# Altium schematic sheet FPGA-Supply.SchDoc
size A2; Date: Date; CompanyName: HESSO; Engineer: Name; Address1: Route du Rawyl 47; Address2: 1950 Sion; Address3: Switzerland; ProjectName: Project Name
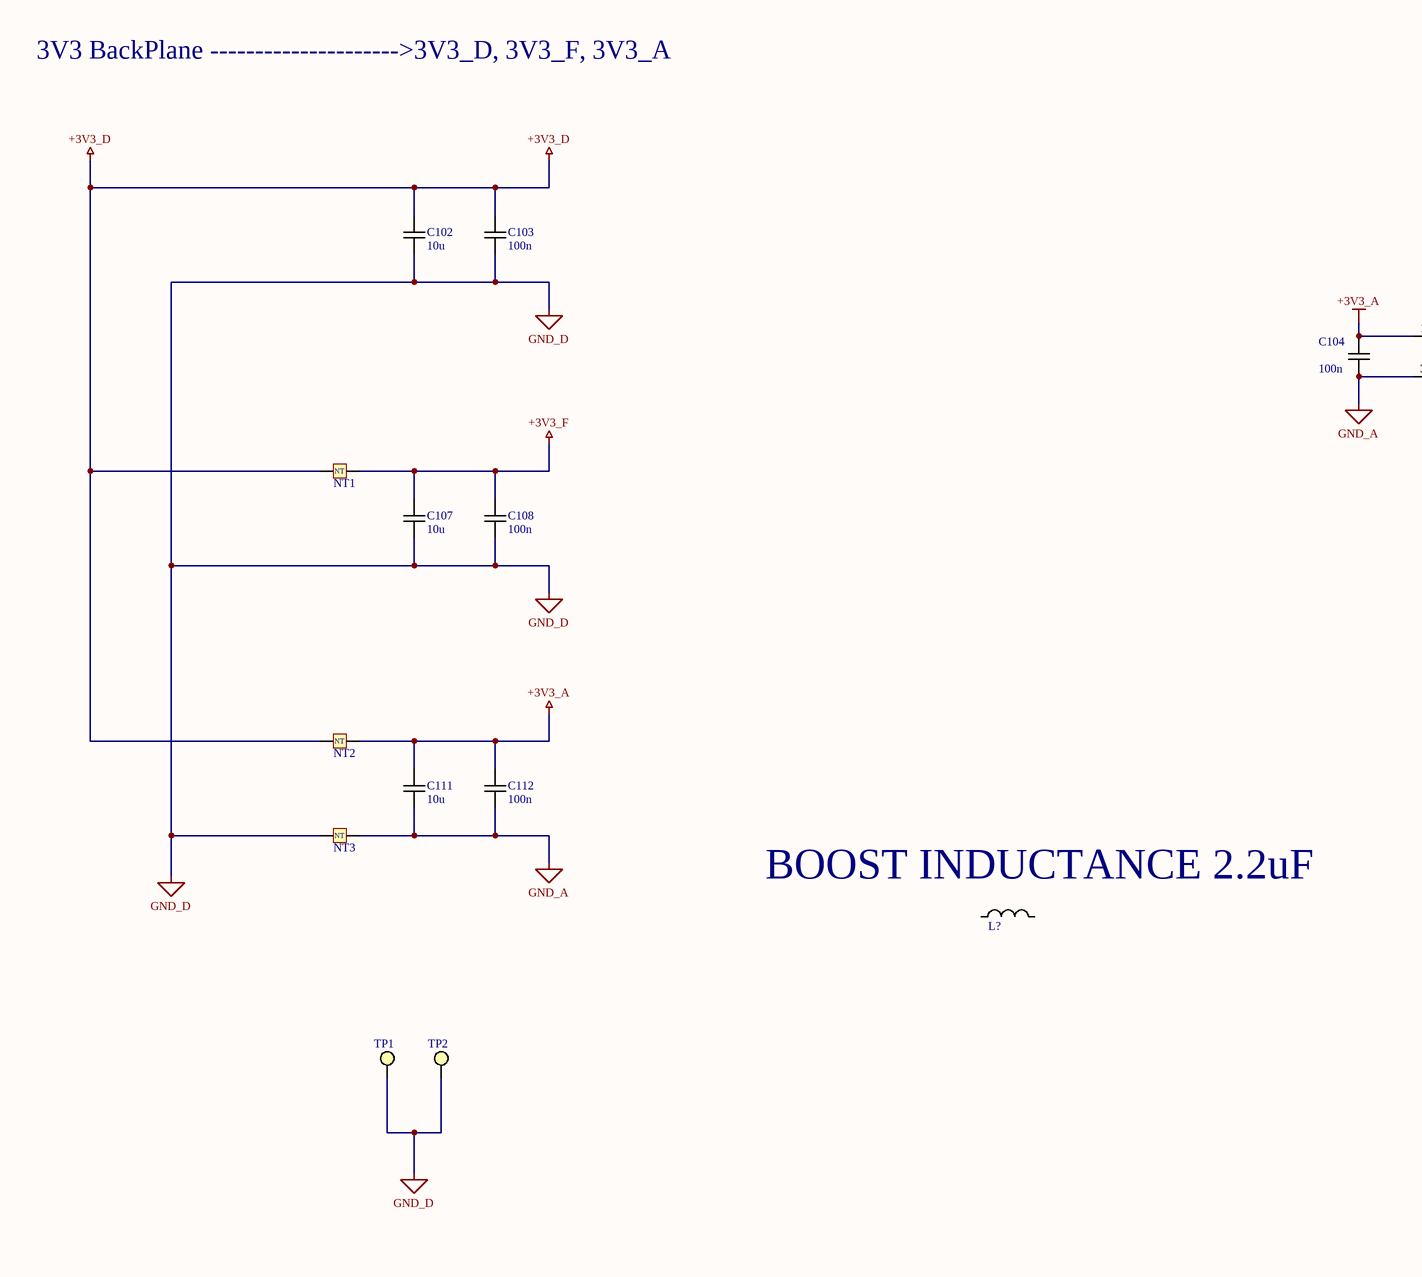
[diagram p0: FPGA-Supply.SchDoc, left]
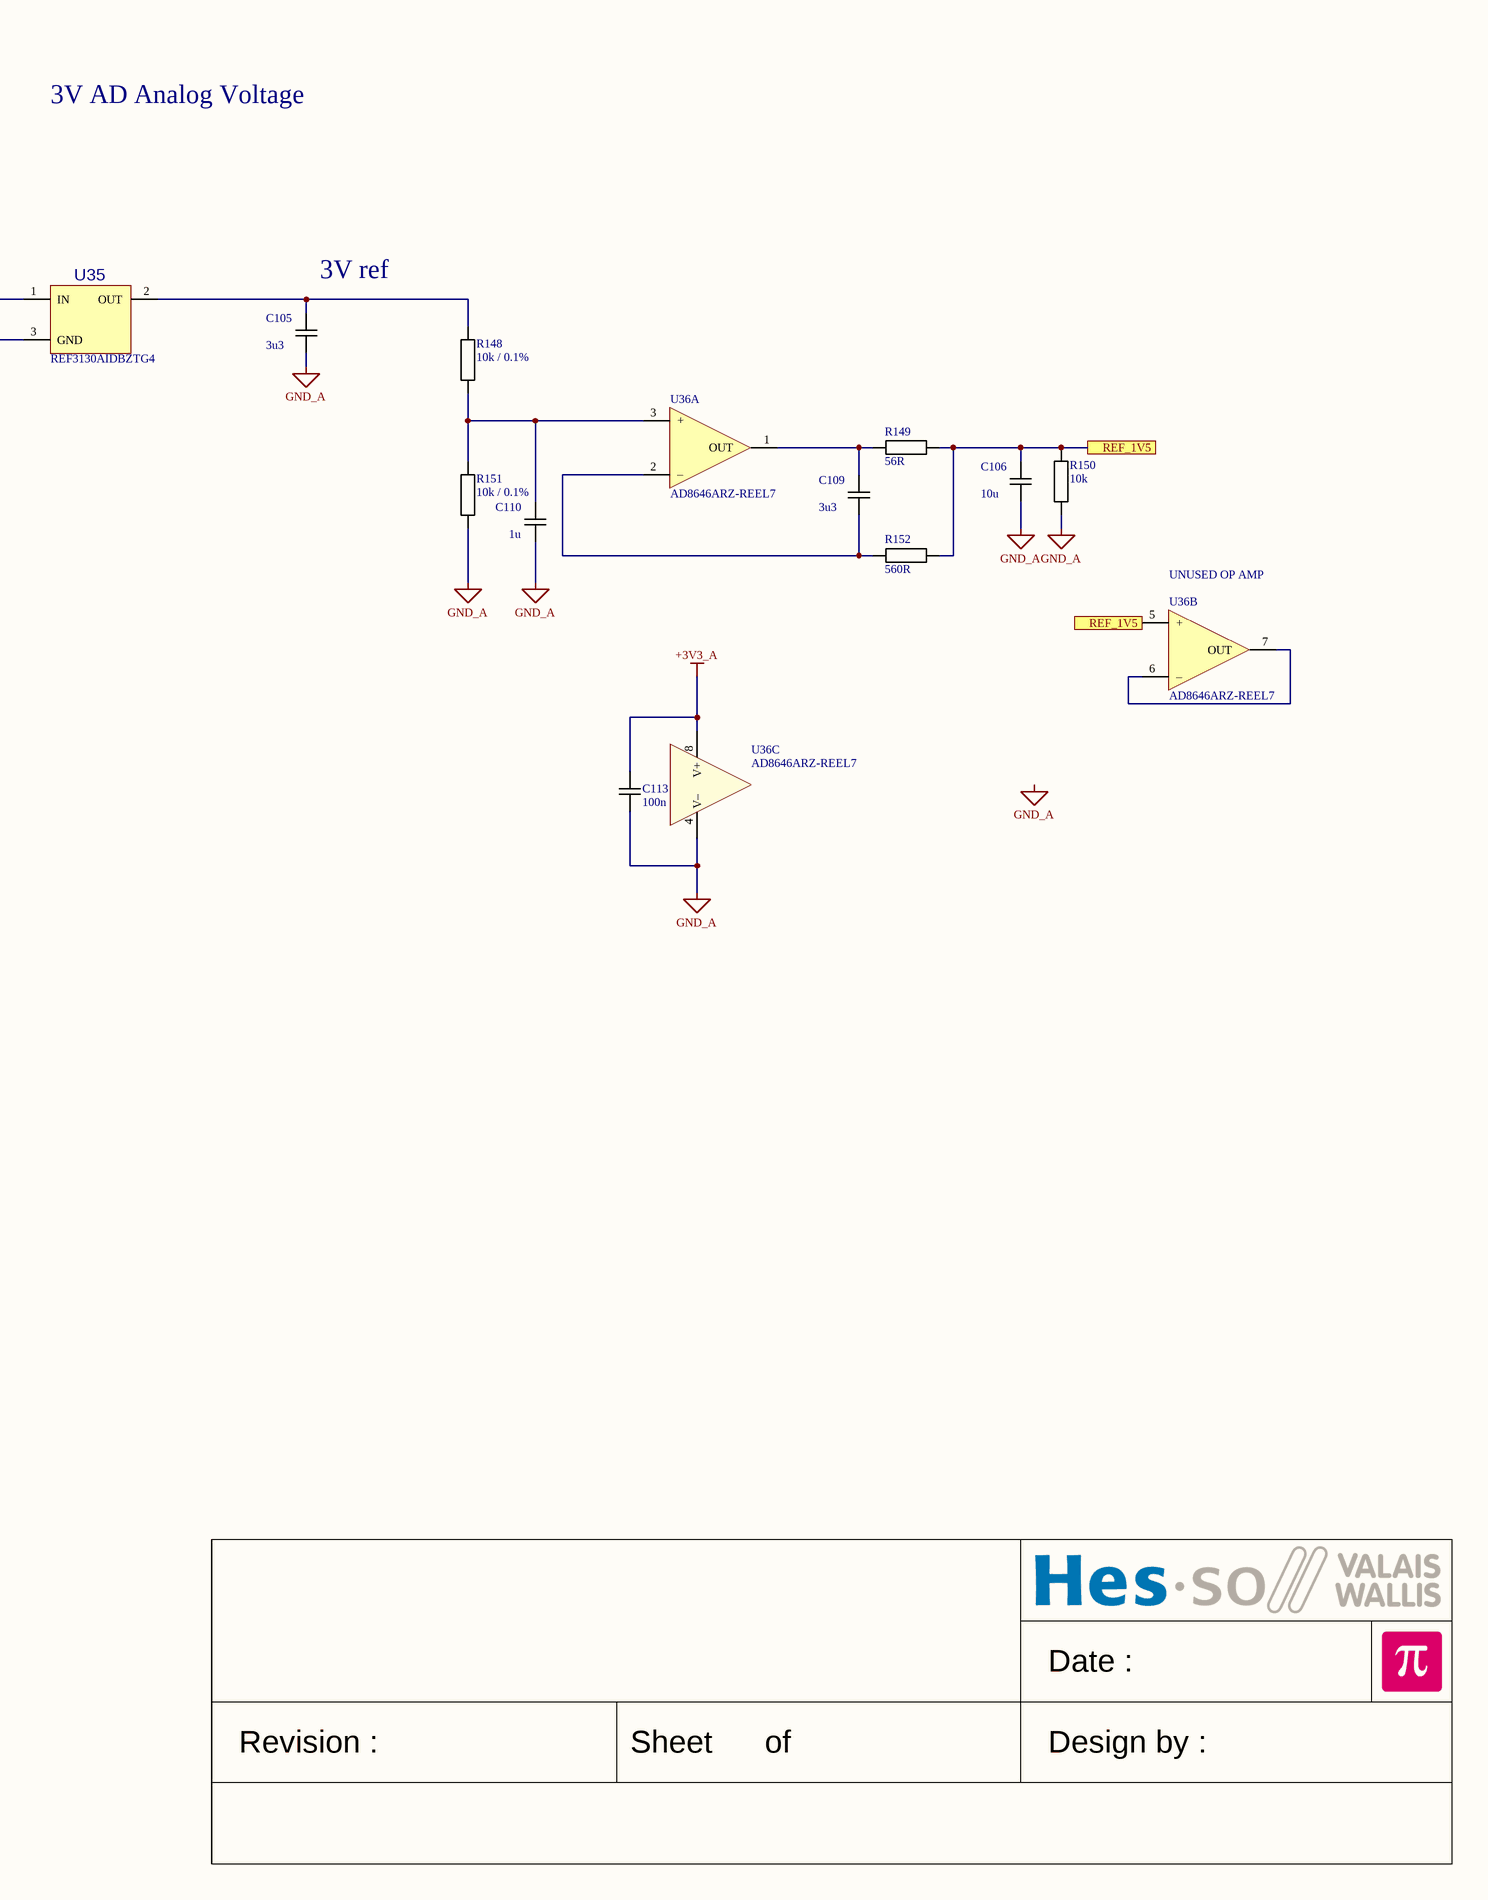
[diagram p1: FPGA-Supply.SchDoc, right]

## Parts
C102  10u  [CAPACITOR 2012 REFLOW]
C103  100n  [CAPACITOR 2012 REFLOW]
C104  100n  [CAPACITOR 1608 REFLOW]
C105  3u3  [CAPACITOR 2012 REFLOW]
C106  10u  [CAPACITOR 2012 REFLOW]
C107  10u  [CAPACITOR 2012 REFLOW]
C108  100n  [CAPACITOR 2012 REFLOW]
C109  3u3  [CAPACITOR 2012 REFLOW]
C110  1u  [CAPACITOR 2012 REFLOW]
C111  10u  [CAPACITOR 2012 REFLOW]
C112  100n  [CAPACITOR 2012 REFLOW]
C113  100n  [CAPACITOR 1608 REFLOW]
L?  NRS5020T2R2NMGJ  [TDK VLCF5020-1]  (value not drawn)
NT1  Net Tie  [NET TIE 1005]  (value not drawn)  (net tie, no BOM)
NT2  Net Tie  [NET TIE 1005]  (value not drawn)  (net tie, no BOM)
NT3  Net Tie  [NET TIE 1005]  (value not drawn)  (net tie, no BOM)
R148  10k / 0.1%  [RESISTOR 1608 REFLOW]
R149  56R  [RESISTOR 1608 REFLOW]
R150  10k  [RESISTOR 1608 REFLOW]
R151  10k / 0.1%  [RESISTOR 1608 REFLOW]
R152  560R  [RESISTOR 1608 REFLOW]
TP1  *  [Test Point Keystone Miniature BLACK]  (value not drawn)
TP2  *  [Test Point Keystone Miniature BLACK]  (value not drawn)
U35  REF3130AIDBZTG4  [SOT23 P0.95 C1.6x3.0 H1.3]
U36  AD8646ARZ-REEL7  [SO8 P1.27 C4.0X5.0 H1.75]  (parts A,B,C of 3)

## Ports
REF_1V5

## Nets
+3V3_A: C104.2 C111.1 C112.1 C113.2 NT2.2 U35.1(IN) U36.8(V+)
+3V3_D: C102.1 C103.1 NT1.1 NT2.1
+3V3_F: C107.1 C108.1 NT1.2
GND_A: C104.1 C105.1 C106.1 C110.1 C111.2 C112.2 C113.1 NT3.2 R150.2 R151.2 U35.3(GND) U36.4(V–)
GND_D: C102.2 C103.2 C107.2 C108.2 NT3.1 TP1.1 TP2.1
REF_1V5: C106.2 R149.1 R150.1 R152.1 U36.5(+) ; port REF_1V5
NetC105_2: C105.2 R148.2 U35.2(OUT)
NetC109_1: C109.1 R152.2 U36.2(–)
NetC109_2: C109.2 R149.2 U36.1(OUT)
NetC110_2: C110.2 R148.1 R151.1 U36.3(+)
NetU36_6: U36.6(–) U36.7(OUT)

Not connected (* = marked no-connect by the designer): L? 1 2

## Notes on the sheet
- 3V3 BackPlane --------------------->3V3_D, 3V3_F, 3V3_A
- 3V AD Analog Voltage
- (near C105) 3V ref
- (near U36) UNUSED OP AMP
- (near L?) BOOST INDUCTANCE 2.2uF
- Date :
- Revision :
- Sheet
- of
- Design by :
- Labels drawn without touching a wire or pin: GND_A
- (in symbol Net Tie) NT

## Library data of the parts
C102 C105-C107 C109-C111 = Capacitor: Capacitor X7R 10% 10V 2012(0805)
  C102 C106 C107 C111: Value: 10u
  C105 C109: Value: 3u3
  C110: Value: 1u
C103 C108 C112 = Capacitor: Capacitor X7R 10% 50V 2012(0805); Value: 100n
C104 C113 = Capacitor: Capacitor X7R 10% 50V 1608(0603); Value: 100n
L? = Inductor: Value: NRS5020T2R2NMGJ
NT1-NT3 = Net Tie: Connection for 2 different NETNAME
R148-R152 = Resistor: Resistor 1% 50V 100mW 1608(0603)
  R148 R151: Value: 10k / 0.1%
  R149: Value: 56R
  R150: Value: 10k
  R152: Value: 560R
TP1 TP2 = Test Point: Value: *
U35 = REFERENCE SOT23 IN-OUT- GND: Generic Positive Voltage Reference; Manufacturer: Texas Instruments; Value: REF3130AIDBZTG4; Mouser No.: 595-REF3130AIDBZTG4
U36 = OPA DUAL: Generic dual OPA 8 pins; Manufacturer: Analog Devices; Value: AD8646ARZ-REEL7; Mouser No.: 584-AD8646ARZ-R7